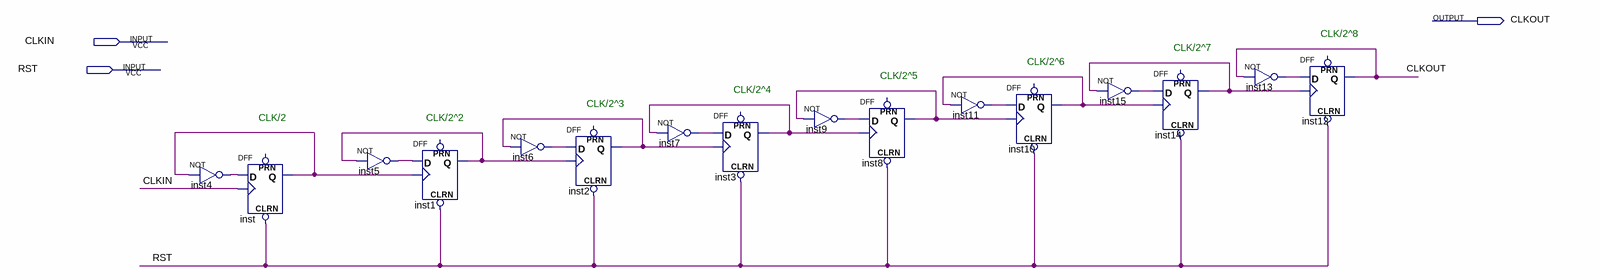
[diagram p0: schematic sheet]
// Quartus schematic CLKDIV2NA8.bdf as structural Verilog: 16 symbols, 3 pins
module CLKDIV2NA8 (
  input  CLKIN,
  input  RST,
  output CLKOUT
);

  wire inst1_q, inst2_q, inst3_q, inst4_out, inst5_out, inst6_out, inst7_out, inst8_q, inst9_out, inst10_q,
       inst11_out, inst13_out, inst14_q, inst15_out, inst_q;

  not inst4 (inst4_out, inst_q);
  DFF inst (.CLRN(RST), .CLK(CLKIN), .D(inst4_out), .Q(inst_q));  // open: PRN
  not inst5 (inst5_out, inst1_q);
  DFF inst1 (.CLRN(RST), .CLK(inst_q), .D(inst5_out), .Q(inst1_q));  // open: PRN
  not inst6 (inst6_out, inst2_q);
  DFF inst2 (.CLRN(RST), .CLK(inst1_q), .D(inst6_out), .Q(inst2_q));  // open: PRN
  not inst7 (inst7_out, inst3_q);
  DFF inst3 (.CLRN(RST), .CLK(inst2_q), .D(inst7_out), .Q(inst3_q));  // open: PRN
  not inst9 (inst9_out, inst8_q);
  DFF inst8 (.CLRN(RST), .CLK(inst3_q), .D(inst9_out), .Q(inst8_q));  // open: PRN
  not inst11 (inst11_out, inst10_q);
  DFF inst10 (.CLRN(RST), .CLK(inst8_q), .D(inst11_out), .Q(inst10_q));  // open: PRN
  not inst15 (inst15_out, inst14_q);
  DFF inst14 (.CLRN(RST), .CLK(inst10_q), .D(inst15_out), .Q(inst14_q));  // open: PRN
  not inst13 (inst13_out, CLKOUT);
  DFF inst12 (.CLRN(RST), .CLK(inst14_q), .D(inst13_out), .Q(CLKOUT));  // open: PRN

  // Notes on the sheet:
  //   CLK/2^8
  //   CLK/2^7
  //   CLK/2^6
  //   CLK/2^5
  //   CLK/2^4
  //   CLK/2^3
  //   CLK/2
  //   CLK/2^2
endmodule
